# EAGLE design rx-audio breakout (EAGLE 6.2)
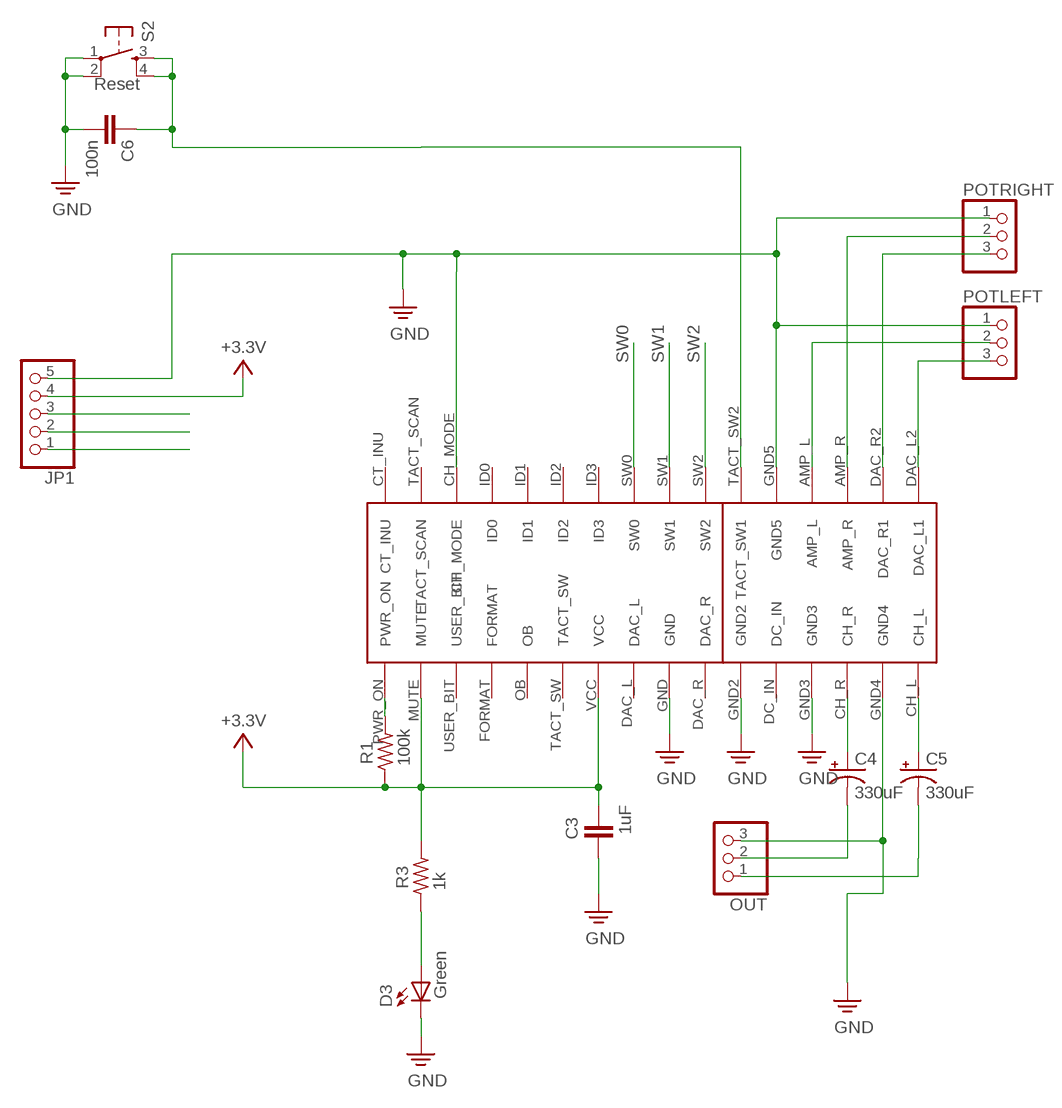
[diagram p0: schematic, sheet 1]

## Parts
C3  1uF  CAPACITOR0805  [0805A]
C4  330uF  CPOL-USSMCD  [SMC_D]
C5  330uF  CPOL-USSMCD  [SMC_D]
C6  100n  C-EUC0805  [C0805]
D3  Green  LED0603  [LED-0603]
JP1  PINHD-1X5  [1X05]
OUT  PINHD-1X3  [1X03]
POTLEFT  PINHD-1X3  [1X03]
POTRIGHT  PINHD-1X3  [1X03]
R1  100k  RESISTOR0805  [0805A]
R3  1k  RESISTOR0805  [0805A]
S2  Reset  TAC_SWITCHSMD  [TACTILE_SWITCH_SMD]
U$1  RX-AUDIO-2.4VERTICAL  [AUREL_RX-AUDIO-2.4GH-TRH]

## Nets
GND: C3.+ C6.2 D3.C JP1.5 OUT.3 POTLEFT.1 POTRIGHT.1 S2.1 S2.2 U$1.CH_MODE U$1.GND U$1.GND2 U$1.GND3 U$1.GND4 U$1.GND5
LINE_IN: C5.- OUT.1
N2 [gnd]: C6.1 S2.3 S2.4 U$1.TACT_SW2(TACT_SW1)
N$2: C4.+ U$1.CH_R
N$3: C5.+ U$1.CH_L
N$4: POTLEFT.2 U$1.AMP_L
N$5: D3.A R3.+
N$6: R1.- U$1.PWR_ON
N$7: POTLEFT.3 U$1.DAC_L2(DAC_L1)
N$8: POTRIGHT.3 U$1.DAC_R2(DAC_R1)
N$9: POTRIGHT.2 U$1.AMP_R
N$14: C4.- OUT.2
SW0: JP1.1 U$1.SW0
SW1: JP1.2 U$1.SW1
SW2: JP1.3 U$1.SW2
VCC: C3.- JP1.4 R1.+ R3.- U$1.MUTE U$1.VCC ; supply symbol labelled +3.3V
Unconnected: U$1.CT_INU U$1.DAC_L U$1.DAC_R U$1.DC_IN U$1.FORMAT U$1.ID0 U$1.ID1 U$1.ID2 U$1.ID3 U$1.OB U$1.TACT_SCAN U$1.TACT_SW U$1.USER_BIT

## Library data of the parts
C3 = audioint:CAPACITOR
C4 C5 = rcl:CPOL-US: POLARIZED CAPACITOR, American symbol
C6 = SmartPrj:C-EU: CAPACITOR, European symbol
D3 = SparkFun:LED: LEDs Standard schematic elements and footprints for 5mm, 3mm, 1206, and 0603 sized LEDs. 5mm - Spark Fun Electronics SKU : COM-00529 (and others)
JP1 = pinhead:PINHD-1X5: PIN HEADER
OUT POTLEFT POTRIGHT = pinhead:PINHD-1X3: PIN HEADER
R1 R3 = audioint:RESISTOR
S2 = SparkFun:TAC_SWITCH: Momentary Switch Button commonly used for reset or general input. Spark Fun Electronics SKU : COM-00097
U$1 = aurel:RX-AUDIO-2.4: MODULE, RECEIVER, 2.4GHZ, AUDIO Development Tool Type: Hardware - Module Kit Features: 2.5GHz Frequency, Compatible with Digital Audio Transmitter TX-AUDIO-2.4 Tool / Board Application: Digital Audio Receiver Tool / Board Applications: Ideal to Drive Wireless Speaker, Home Theatre, Headphone Amplifier Type: Digital Audio Receiver url <http://ro.farnell.com/jsp/search/productdetail.jsp?SKU=1699493>

## Net classes
2 gnd: width 0.254 mm, drill 0.61 mm, clearance 0.254 mm

## Board
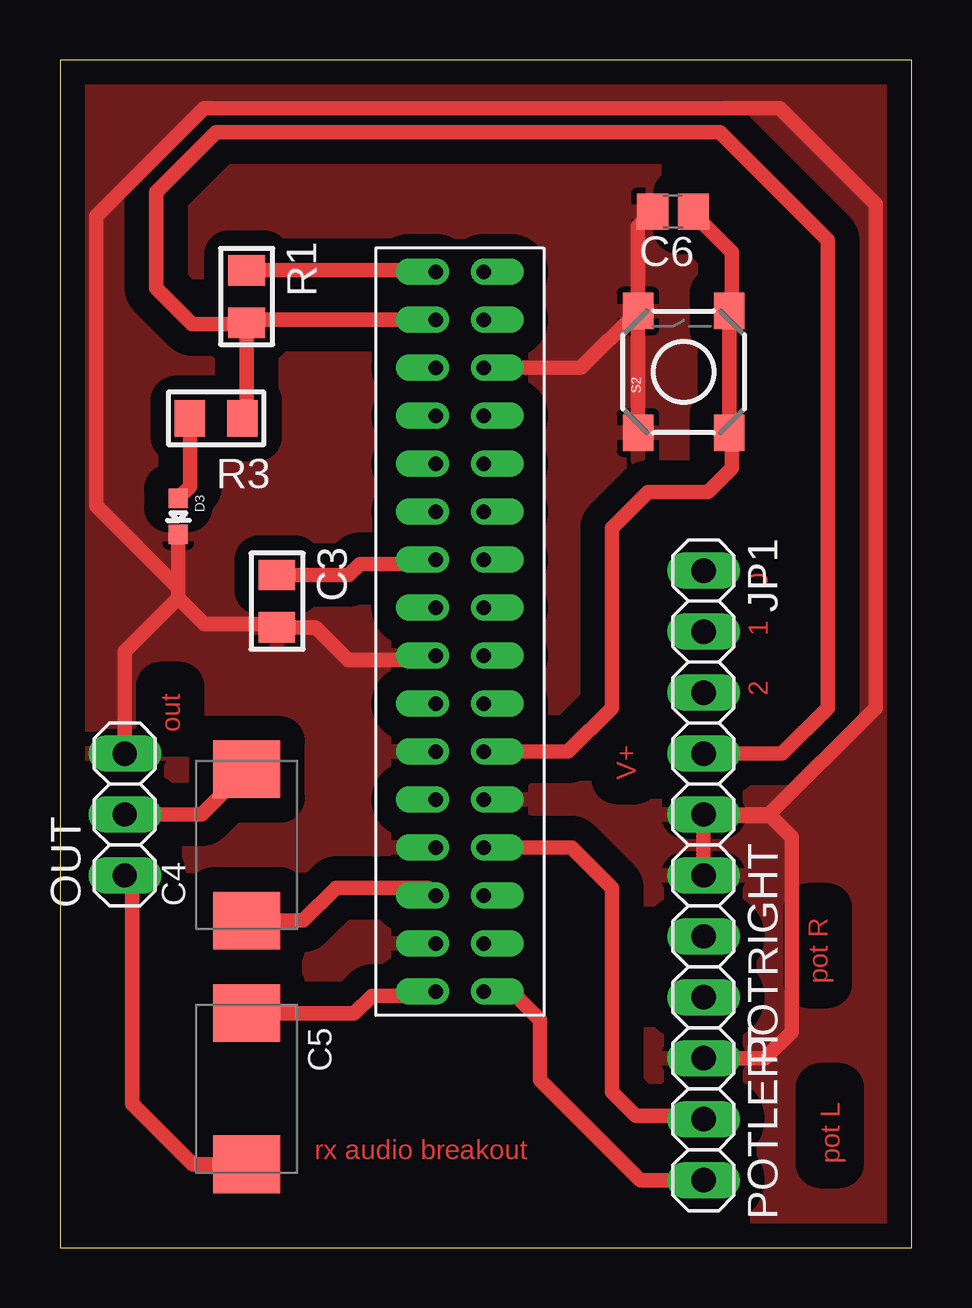
[diagram p1: board, top side]
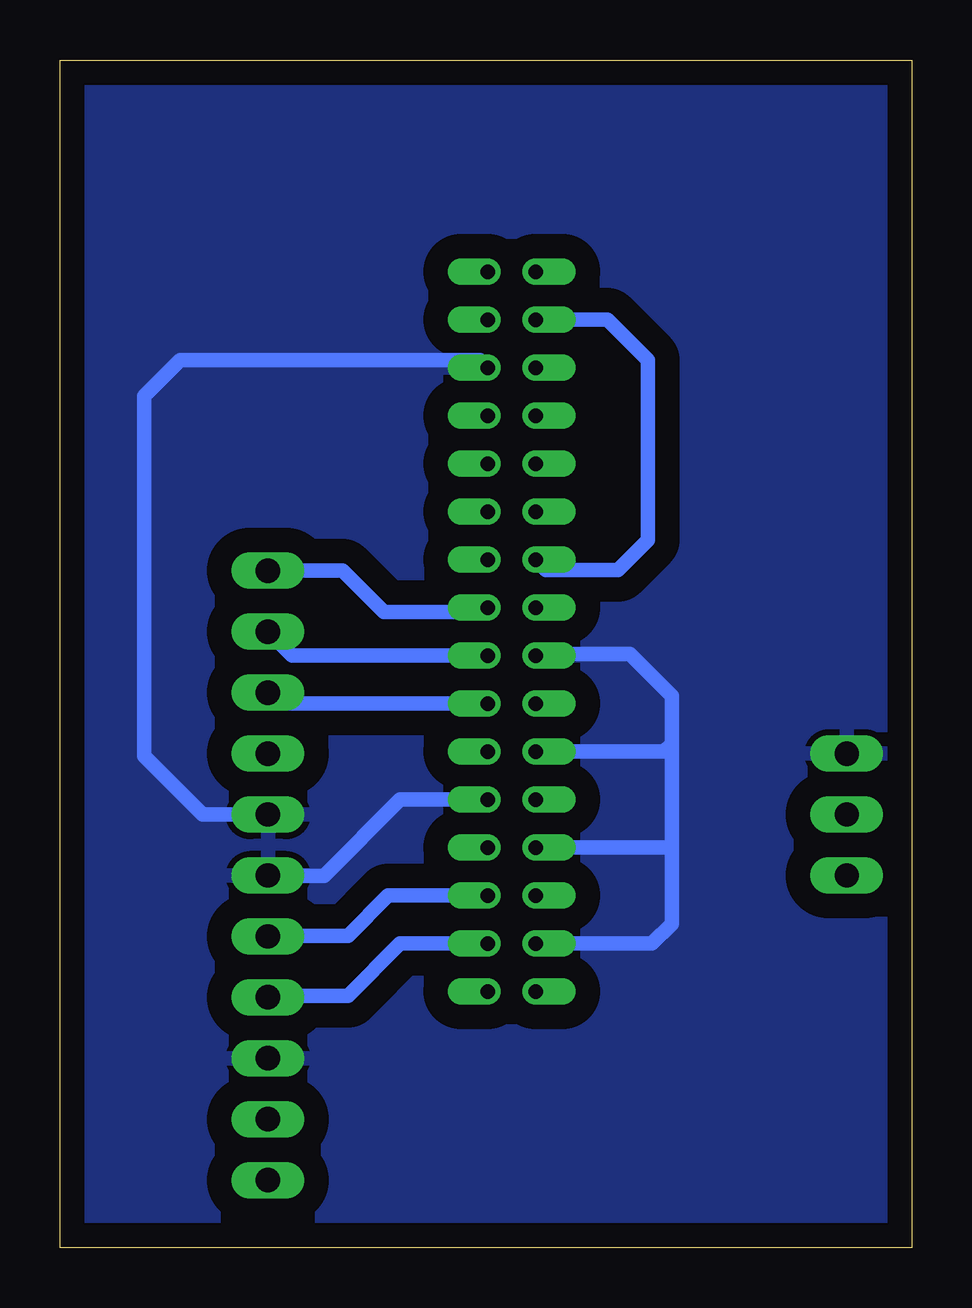
[diagram p2: board, bottom side, seen from below]

Size 35.5 x 49.5 mm. Coordinates in mm from the lower left corner, seen from the top.
Outline: 0,0 35.5,0 35.5,49.5 0,49.5 0,0
Copper layers (1*16): Top 0.035mm / dielectric 1.5mm / Bottom 0.035mm
Design rules: minimum track width 10mil, minimum drill 24mil, track to track 8mil, track to pad 8mil, pad to pad 8mil, via to via 8mil, smd to smd 8mil, copper to edge 40mil, drill to drill 8mil, minimum pad ring 10mil, minimum via ring 8mil, stop-mask expansion 4mil, vias tented up to drill 0mil, thermal gap 10mil

### Footprints (pad centres in the part's own frame; a part is rotated, then mirrored left to right if it is on the bottom)
0805A = smd 1.27 x 1.524: + 1.091,0; - -1.091,0
SMC_D = smd 2.4 x 2.8: + -3.15,0; - 3.15,0
C0805 = smd 1.3 x 1.5: 1 -0.85,0; 2 0.85,0
LED-0603 = smd 0.8 x 0.8: A 0,-0.75; C 0,0.75
1X05 = drill 1.016 long: 1 -5.08,0; 2 -2.54,0; 3 0,0; 4 2.54,0; 5 5.08,0
1X03 = drill 1.016 long: 1 -2.54,0; 2 0,0; 3 2.54,0
TACTILE_SWITCH_SMD = smd 1.524 x 1.27: 1 -2.54,1.905; 2 2.54,1.905; 3 -2.54,-1.905; 4 2.54,-1.905
AUREL_RX-AUDIO-2.4GH-TRH = drill 0.6 offset: AMP_L 1,-9; AMP_R 1,-11; CH_L -1,-15; CH_MODE 1,11; CH_R -1,-11; CT_INU 1,15; DAC_L -1,1; DAC_L2 1,-15; DAC_R -1,-3; DAC_R2 1,-13; DC_IN -1,-7; FORMAT -1,9; GND -1,-1; GND2 -1,-5; GND3 -1,-9; GND4 -1,-13; GND5 1,-7; ID0 1,9; ID1 1,7; ID2 1,5; ID3 1,3; MUTE -1,13; OB -1,7; PWR_ON -1,15; SW0 1,1; SW1 1,-1; SW2 1,-3; TACT_SCAN 1,13; TACT_SW -1,5; TACT_SW2 1,-5; USER_BIT -1,11; VCC -1,3

### Placement (x,y rotation side)
C3  9.05,26.94 270 top
C4  7.78,16.78 90 top
C5  7.78,6.62 270 top
C6  25.56,43.18 180 top
D3  4.93,30.48 180 top
JP1  26.83,23.13 270 top
OUT  2.7,18.05 90 top
POTLEFT  26.83,5.35 270 top
POTRIGHT  26.83,12.97 270 top
R1  7.78,39.64 270 top
R3  6.51,34.56 180 top
S2  26,36.5 90 top
U$1  16.67,25.67 0 top

### Tracks (layer width: path | path; a pad name or v marks a point on that pad's centre or on a via)
GND
  Top 0.61: D3.C 4.93,27.5 | 4.93,27.5 4.93,27.07 | 4.93,27.07 6,26 8.9,26 C3.+ 10.65,25.85 12,24.5 15.5,24.5 U$1.GND | OUT.3 2.7,24.84 4.93,27.07 | 29.55,18.05 34,22.5 34,43.5 30,47.5 6,47.5 1.5,43 1.5,30.93 4.93,27.5 | JP1.5 POTRIGHT.1 | POTLEFT.1 29.39,7.89 30.5,9 30.5,17.1 29.8,17.8 | 29.8,17.8 29.55,18.05 | U$1.CH_MODE 21.73,36.67 S2.2 | S2.2 24.09,42.56 C6.2 | S2.1 S2.2 | S2.2 24.09,39.41 24,39.5 24,39.13 S2.2 | 29.55,18.05 27.45,18.05 27,18.5 27,18 29.6,18 29.8,17.8
  Bottom 0.61: U$1.GND4 10.83,12.67 10,13.5 10,16.5 | 10,16.5 10,21 | 10,21 10,23 11.75,24.75 15.59,24.75 U$1.GND | U$1.GND2 10.33,20.67 10,21 | U$1.GND3 10.17,16.67 10,16.5 | U$1.GND5 21.33,18.67 24.5,15.5 POTRIGHT.1 | JP1.5 29.55,18.05 32,20.5 32,35.5 30.5,37 18,37 U$1.CH_MODE
  pour Top (isolate 1.016): 0,49 35.5,49 35.5,0 0,0
  pour Bottom (isolate 1.016): 0.5,49 35.5,49 35.5,0 0.5,0
LINE_IN
  Top 0.61: C5.- 5.53,3.47 3,6 3,15.21 OUT.1
N2
  Top 0.61: C6.1 26.41,43.09 28,41.5 28,39.13 S2.4 27.91,34.5 | 27.91,34.5 S2.3 | U$1.TACT_SW2 21.17,20.67 23,22.5 23,30 24.5,31.5 27,31.5 28,32.5 28,34.41 27.91,34.5
N$2
  Top 0.61: C4.+ 10.13,13.63 11.5,15 15.34,15 U$1.CH_R
N$3
  Top 0.61: C5.+ 12.27,9.77 13,10.5 15.5,10.5 U$1.CH_L
N$4
  Top 0.61: U$1.AMP_L 21.33,16.67 23,15 23,6.5 24,5.5 26.68,5.5 POTLEFT.2
N$5
  Top 0.61: R3.+ 5.42,31.72 D3.A
N$6
  Top 0.61: R1.- 15.61,40.73 U$1.PWR_ON
N$7
  Top 0.61: POTLEFT.3 24.19,2.81 20,7 20,9.5 19,10.5 17.84,10.5 U$1.DAC_L2
N$8
  Bottom 0.61: U$1.DAC_R2 21.33,12.67 23.5,10.5 26.76,10.5 POTRIGHT.3
N$9
  Bottom 0.61: U$1.AMP_R 21.83,14.67 23.5,13 26.8,13 POTRIGHT.2
N$14
  Top 0.61: OUT.2 5.9,18.05 C4.-
SW0
  Bottom 0.61: JP1.1 23.71,28.21 22,26.5 17.84,26.5 U$1.SW0
SW1
  Bottom 0.61: U$1.SW1 25.83,24.67 JP1.2
SW2
  Bottom 0.61: U$1.SW2 26.37,22.67 JP1.3
VCC
  Top 0.61: U$1.MUTE 7.9,38.67 R1.+ | R1.+ 7.78,34.74 R3.- | C3.- 12.03,28.03 12.5,28.5 15.5,28.5 U$1.VCC | JP1.4 30.09,20.59 32,22.5 32,42 27.5,46.5 6.5,46.5 4,44 4,40 5.5,38.5 7.73,38.5 R1.+
  Bottom 0.61: U$1.MUTE 12.67,38.67 11,37 11,29.5 12.25,28.25 15.25,28.25 U$1.VCC

### Text on the board
Top: 0 | 1 | 2 | out | V+ | pot R | rx audio breakout | pot L